# EAGLE board Blueberry Pi (EAGLE 9.0.0), part 1 of 2
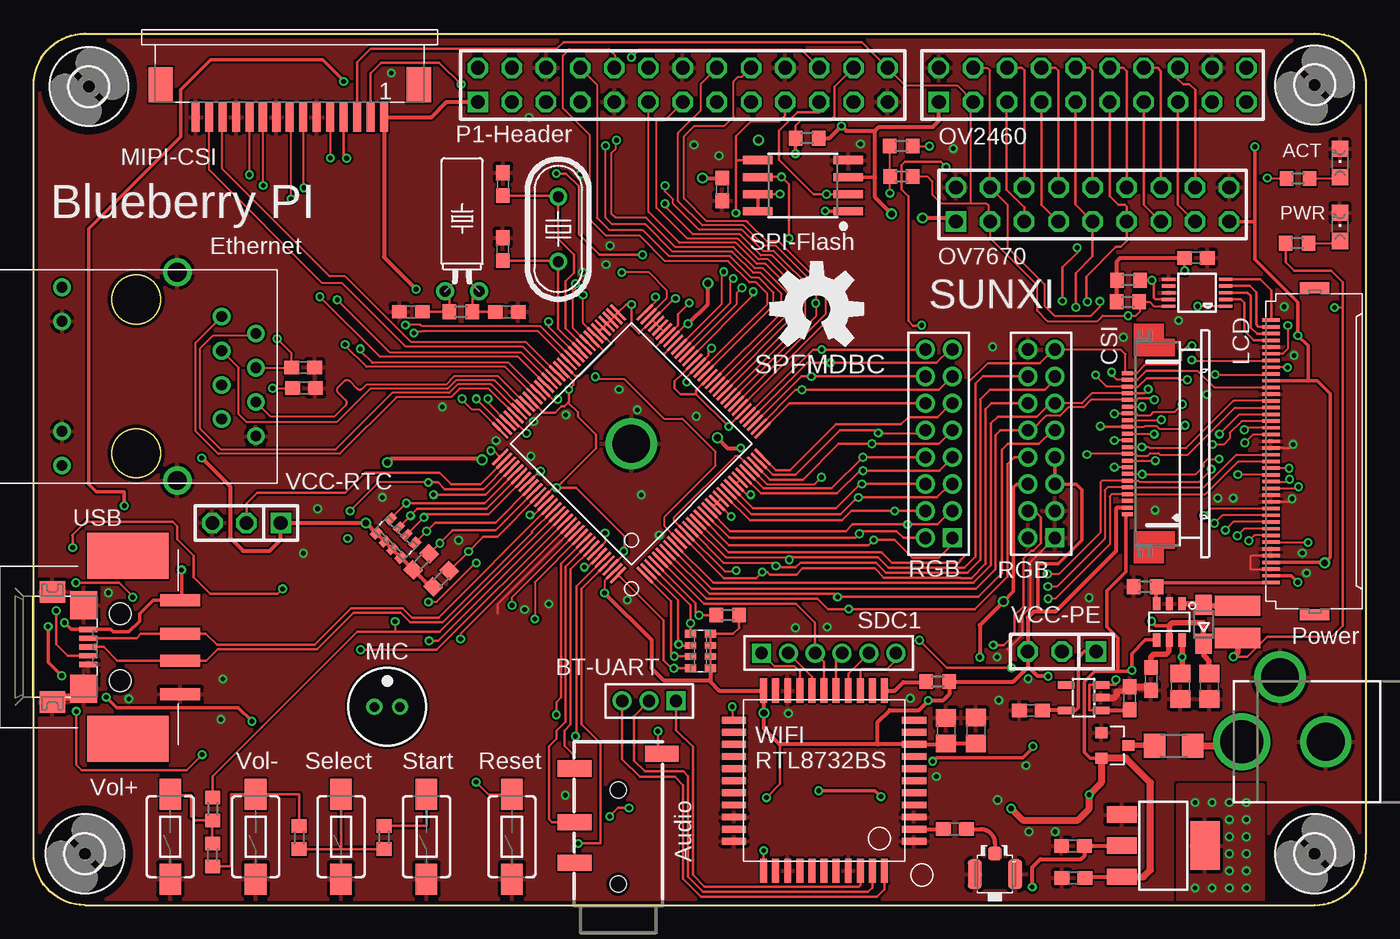
[diagram p4: board, top side]
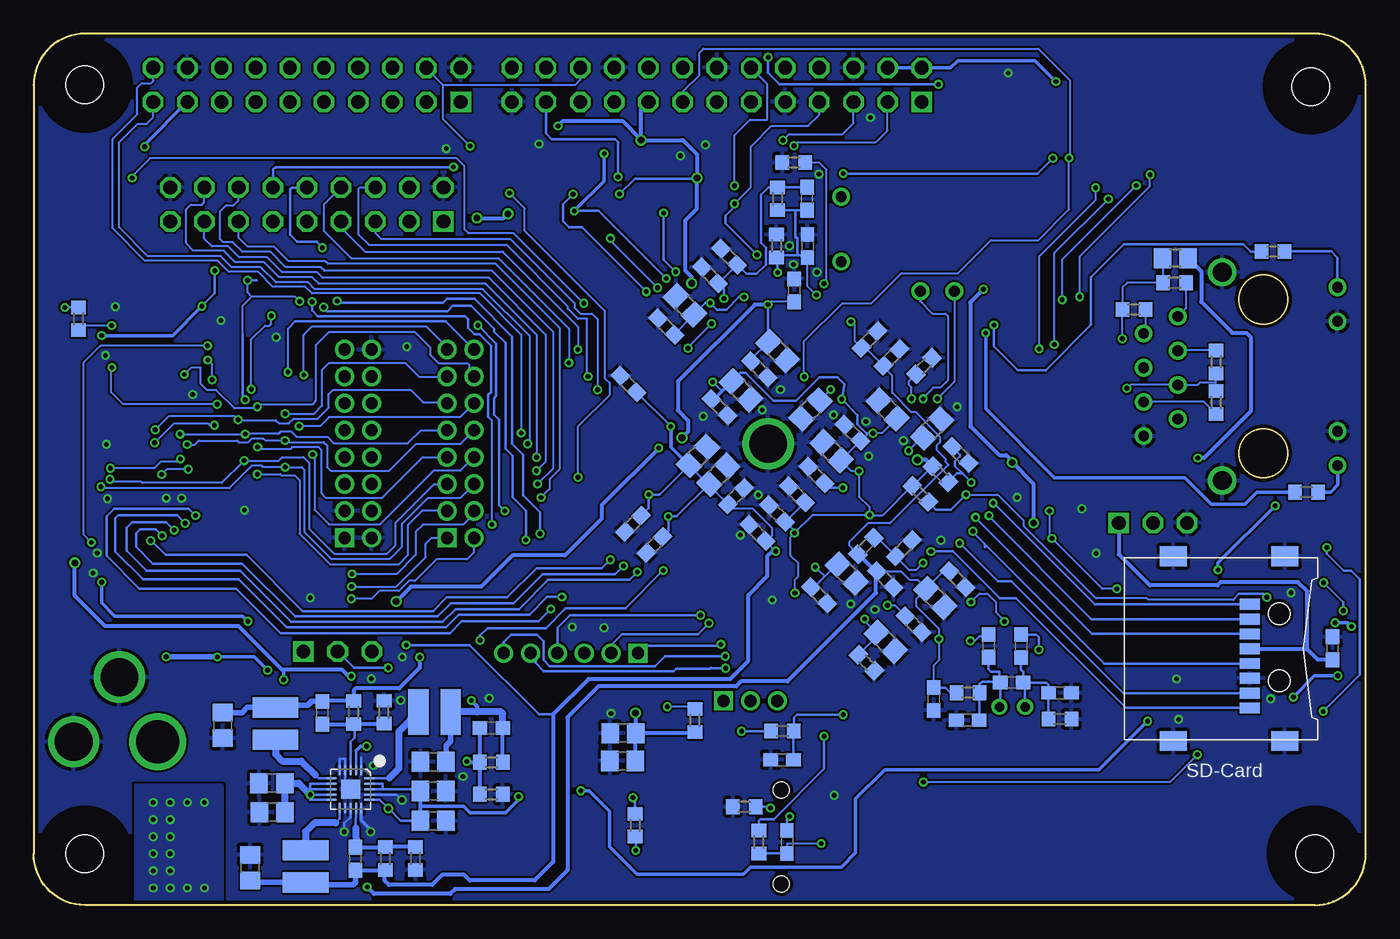
[diagram p5: board, bottom side, seen from below]

Size 99.06 x 64.77 mm. Coordinates in mm from the lower left corner, seen from the top.
Outline: 3.81,0 95.25,0 arc90 99.06,3.81 99.06,60.96 arc90 95.25,64.77 3.81,64.77 arc90 0,60.96 0,3.81 arc90 3.81,0
Copper layers (1*16): Top 0.035mm / dielectric 1.5mm / Bottom 0.035mm
Design rules "SeeedStudio_2layer_DRU_no_angle_20140221": minimum track width 6mil, minimum drill 12mil, track to track 6mil, track to pad 6mil, pad to pad 6mil, via to via 6mil, smd to smd 0mil, copper to edge 10mil, drill to drill 10mil, minimum pad ring 10mil, minimum via ring 6mil, stop-mask expansion 2mil, vias tented up to drill 100mil, thermal gap 10mil
Net classes: 0 default: clearance 0.152 mm

## Footprints (pad centres in the part's own frame; a part is rotated, then mirrored left to right if it is on the bottom)
U-FL3P-SMD-2.6X2.6X1.0MM = smd 1.05 x 1: D -1.524,0 | smd 2.2 x 1.05: GND1 0,1.5; GND2 0,-1.5
C0603 = smd 1.1 x 1: 1 -0.85,0; 2 0.85,0
C0805 = smd 1.3 x 1.5: 1 -0.95,0; 2 0.95,0
DCJACK_2MM_PTH = drill 2.8: GND 0,7.35; GNDBREAK 4.8,10.75 | drill 3.2: PWR 0,13.6
SOD323-W = smd 1.5 x 1.2: A 1.45,0; C -1.45,0
R1206 = smd 1.6 x 1.803: 1 -1.422,0; 2 1.422,0
2,8 = hole 2.8: 0,0
SOT223 = smd 1.219 x 2.235: 1 -2.311,-3.099; 2 0,-3.099; 3 2.311,-3.099 | smd 3.6 x 2.2: 4 0,3.099
TRANSFLASH-LOCK-SOCK = smd 0.8 x 1.5: 1 3.3,-0.46; 2 2.2,-0.46; 3 1.1,-0.46; 4 0,-0.46; 5 -1.1,-0.46; 6 -2.2,-0.46; 7 -3.3,-0.46; 8 -4.4,-0.46 | smd 1.45 x 2: S1 -6.875,-3.06; S2 -6.875,5.24; S3 6.875,5.24; S4 6.875,-3.06
AUDIO_JACK_3.5MM_TRRS_SMD_RA = smd 1.2 x 2.5: EARTH 11.3,-3.25; RING1 6.2,3.25; RING2 3.2,3.25; TIP 10.2,3.25 | hole 1.2: 1.6,0; 8.6,0
XF2H-4015-1LW = smd 1.3 x 0.25: 1 3.175,9.75; 2 3.175,9.25; 3 3.175,8.75; 4 3.175,8.25; 5 3.175,7.75; 6 3.175,7.25; 7 3.175,6.75; 8 3.175,6.25; 9 3.175,5.75; 10 3.175,5.25; 11 3.175,4.75; 12 3.175,4.25; 13 3.175,3.75; 14 3.175,3.25; 15 3.175,2.75; 16 3.175,2.25; 17 3.175,1.75; 18 3.175,1.25; 19 3.175,0.75; 20 3.175,0.25; 21 3.175,-0.25; 22 3.175,-0.75; 23 3.175,-1.25; 24 3.175,-1.75; 25 3.175,-2.25; 26 3.175,-2.75; 27 3.175,-3.25; 28 3.175,-3.75; 29 3.175,-4.25; 30 3.175,-4.75; 31 3.175,-5.25; 32 3.175,-5.75; 33 3.175,-6.25; 34 3.175,-6.75; 35 3.175,-7.25; 36 3.175,-7.75; 37 3.175,-8.25; 38 3.175,-8.75; 39 3.175,-9.25; 40 3.175,-9.75 | smd 2.2 x 0.8: M1 -0.075,12.15; M2 -0.075,-12.15
68611514122 = smd 0.6 x 2.2: 1 -7,2.4; 2 -6,2.4; 3 -5,2.4; 4 -4,2.4; 5 -3,2.4; 6 -2,2.4; 7 -1,2.4; 8 0,2.4; 9 1,2.4; 10 2,2.4; 11 3,2.4; 12 4,2.4; 13 5,2.4; 14 6,2.4; 15 7,2.4 | smd 1.8 x 2.6: Z1 -9.6,0; Z2 9.6,0
2X13 = drill 1.016 square: 1 -15.24,-1.27 | drill 1.016 octagon: 2 -15.24,1.27; 3 -12.7,-1.27; 4 -12.7,1.27; 5 -10.16,-1.27; 6 -10.16,1.27; 7 -7.62,-1.27; 8 -7.62,1.27; 9 -5.08,-1.27; 10 -5.08,1.27; 11 -2.54,-1.27; 12 -2.54,1.27; 13 0,-1.27; 14 0,1.27; 15 2.54,-1.27; 16 2.54,1.27; 17 5.08,-1.27; 18 5.08,1.27; 19 7.62,-1.27; 20 7.62,1.27; 21 10.16,-1.27; 22 10.16,1.27; 23 12.7,-1.27; 24 12.7,1.27; 25 15.24,-1.27; 26 15.24,1.27
1X06M = drill 0.914 square: 1 -5,0 | drill 0.914: 2 -3,0; 3 -1,0; 4 1,0; 5 3,0; 6 5,0
1X03 = drill 1.016 square: 1 -2.54,0 | drill 1.016 octagon: 2 0,0; 3 2.54,0
2X09 = drill 1.016 square: 1 -10.16,-1.27 | drill 1.016 octagon: 2 -10.16,1.27; 3 -7.62,-1.27; 4 -7.62,1.27; 5 -5.08,-1.27; 6 -5.08,1.27; 7 -2.54,-1.27; 8 -2.54,1.27; 9 0,-1.27; 10 0,1.27; 11 2.54,-1.27; 12 2.54,1.27; 13 5.08,-1.27; 14 5.08,1.27; 15 7.62,-1.27; 16 7.62,1.27; 17 10.16,-1.27; 18 10.16,1.27
1X03M = drill 0.914 square: 1 -2,0 | drill 0.914: 2 0,0; 3 2,0
2X10 = drill 1.016 square: 1 -11.43,-1.27 | drill 1.016 octagon: 2 -11.43,1.27; 3 -8.89,-1.27; 4 -8.89,1.27; 5 -6.35,-1.27; 6 -6.35,1.27; 7 -3.81,-1.27; 8 -3.81,1.27; 9 -1.27,-1.27; 10 -1.27,1.27; 11 1.27,-1.27; 12 1.27,1.27; 13 3.81,-1.27; 14 3.81,1.27; 15 6.35,-1.27; 16 6.35,1.27; 17 8.89,-1.27; 18 8.89,1.27; 19 11.43,-1.27; 20 11.43,1.27
2X08M = drill 0.914 square: 1 -7,-1 | drill 0.914: 2 -7,1; 3 -5,-1; 4 -5,1; 5 -3,-1; 6 -3,1; 7 -1,-1; 8 -1,1; 9 1,-1; 10 1,1; 11 3,-1; 12 3,1; 13 5,-1; 14 5,1; 15 7,-1; 16 7,1
ODD-INDUCTOR = smd 1.5 x 3.4: P$1 -1.2,0; P$2 1.2,0
L0805 = smd 1.3 x 1.5: 1 -0.95,0; 2 0.95,0
CHIPLED_0805 = smd 1.2 x 1.2: A 0,-1.05; C 0,1.05
F6035AP = drill 0.7 pad 1.2: 1 0,0.95; 2 0,-0.95
HC49U-V = drill 0.813: 1 -2.413,0; 2 2.413,0
TC38H = drill 0.813: 1 -1.27,0; 2 1.27,0
R0603 = smd 1 x 1.1: 1 -0.85,0; 2 0.85,0
EXB38V = smd 0.6 x 0.8: 1 -1.275,-0.75; 4 1.275,-0.75; 5 1.275,0.75; 8 -1.275,0.75 | smd 0.5 x 0.8: 2 -0.4,-0.75; 3 0.4,-0.75; 6 0.4,0.75; 7 -0.4,0.75
TACTILE_SWITCH_SMD_6.0X3.5MM = smd 2.3 x 1.6: 1 -3.15,0; 2 3.15,0
SO08-EIAJ = smd 0.61 x 2.21: 1 -1.905,-3.378; 2 -0.635,-3.378; 3 0.635,-3.378; 4 1.905,-3.378; 5 1.905,3.353; 6 0.635,3.353; 7 -0.635,3.353; 8 -1.905,3.353
QFP-128 = smd 0.2 x 1.6: 1 -6.2,-7.6; 2 -5.8,-7.6; 3 -5.4,-7.6; 4 -5,-7.6; 5 -4.6,-7.6; 6 -4.2,-7.6; 7 -3.8,-7.6; 8 -3.4,-7.6; 9 -3,-7.6; 10 -2.6,-7.6; 11 -2.2,-7.6; 12 -1.8,-7.6; 13 -1.4,-7.6; 14 -1,-7.6; 15 -0.6,-7.6; 16 -0.2,-7.6; 17 0.2,-7.6; 18 0.6,-7.6; 19 1,-7.6; 20 1.4,-7.6; 21 1.8,-7.6; 22 2.2,-7.6; 23 2.6,-7.6; 24 3,-7.6; 25 3.4,-7.6; 26 3.8,-7.6; 27 4.2,-7.6; 28 4.6,-7.6; 29 5,-7.6; 30 5.4,-7.6; 31 5.8,-7.6; 32 6.2,-7.6; 65 6.2,7.6; 66 5.8,7.6; 67 5.4,7.6; 68 5,7.6; 69 4.6,7.6; 70 4.2,7.6; 71 3.8,7.6; 72 3.4,7.6; 73 3,7.6; 74 2.6,7.6; 75 2.2,7.6; 76 1.8,7.6; 77 1.4,7.6; 78 1,7.6; 79 0.6,7.6; 80 0.2,7.6; 81 -0.2,7.6; 82 -0.6,7.6; 83 -1,7.6; 84 -1.4,7.6; 85 -1.8,7.6; 86 -2.2,7.6; 87 -2.6,7.6; 88 -3,7.6; 89 -3.4,7.6; 90 -3.8,7.6; 91 -4.2,7.6; 92 -4.6,7.6; 93 -5,7.6; 94 -5.4,7.6; 95 -5.8,7.6; 96 -6.2,7.6 | smd 1.6 x 0.2: 33 7.6,-6.2; 34 7.6,-5.8; 35 7.6,-5.4; 36 7.6,-5; 37 7.6,-4.6; 38 7.6,-4.2; 39 7.6,-3.8; 40 7.6,-3.4; 41 7.6,-3; 42 7.6,-2.6; 43 7.6,-2.2; 44 7.6,-1.8; 45 7.6,-1.4; 46 7.6,-1; 47 7.6,-0.6; 48 7.6,-0.2; 49 7.6,0.2; 50 7.6,0.6; 51 7.6,1; 52 7.6,1.4; 53 7.6,1.8; 54 7.6,2.2; 55 7.6,2.6; 56 7.6,3; 57 7.6,3.4; 58 7.6,3.8; 59 7.6,4.2; 60 7.6,4.6; 61 7.6,5; 62 7.6,5.4; 63 7.6,5.8; 64 7.6,6.2; 97 -7.6,6.2; 98 -7.6,5.8; 99 -7.6,5.4; 100 -7.6,5; 101 -7.6,4.6; 102 -7.6,4.2; 103 -7.6,3.8; 104 -7.6,3.4; 105 -7.6,3; 106 -7.6,2.6; 107 -7.6,2.2; 108 -7.6,1.8; 109 -7.6,1.4; 110 -7.6,1; 111 -7.6,0.6; 112 -7.6,0.2; 113 -7.6,-0.2; 114 -7.6,-0.6; 115 -7.6,-1; 116 -7.6,-1.4; 117 -7.6,-1.8; 118 -7.6,-2.2; 119 -7.6,-2.6; 120 -7.6,-3; 121 -7.6,-3.4; 122 -7.6,-3.8; 123 -7.6,-4.2; 124 -7.6,-4.6; 125 -7.6,-5; 126 -7.6,-5.4; 127 -7.6,-5.8; 128 -7.6,-6.2 | drill 2.8: P$1 0,0
LGA = smd 1.8 x 0.51: P$1 -0.7,10.5; P$2 -0.7,9.6; P$3 -0.7,8.7; P$4 -0.7,7.8; P$5 -0.7,6.9; P$6 -0.7,6; P$7 -0.7,5.1; P$8 -0.7,4.2; P$9 -0.7,3.3; P$10 -0.7,2.4; P$11 -0.7,1.5; P$23 12.7,1.5; P$24 12.7,2.4; P$25 12.7,3.3; P$26 12.7,4.2; P$27 12.7,5.1; P$28 12.7,6; P$29 12.7,6.9; P$30 12.7,7.8; P$31 12.7,8.7; P$32 12.7,9.6; P$33 12.7,10.5 | smd 0.51 x 1.8: P$12 1.5,-0.7; P$13 2.4,-0.7; P$14 3.3,-0.7; P$15 4.2,-0.7; P$16 5.1,-0.7; P$17 6,-0.7; P$18 6.9,-0.7; P$19 7.8,-0.7; P$20 8.7,-0.7; P$21 9.6,-0.7; P$22 10.5,-0.7; P$34 10.5,12.7; P$35 9.6,12.7; P$36 8.7,12.7; P$37 7.8,12.7; P$38 6.9,12.7; P$39 6,12.7; P$40 5.1,12.7; P$41 4.2,12.7; P$42 3.3,12.7; P$43 2.4,12.7; P$44 1.5,12.7
RJ45 = drill 0.8: 1 -6.03,-4.12; 2 -8.57,-2.86; 3 -6.03,-1.58; 4 -8.57,-0.32; 5 -6.03,0.96; 6 -8.57,2.22; 7 -6.03,3.5; 8 -8.57,4.76; 9 5.84,-6.305; 10 5.84,-3.765; 11 5.84,4.405; 12 5.84,6.945 | drill 1.4: SHIELD1 -2.73,-7.425; SHIELD2 -2.73,8.065
QFN20 = smd 0.2 x 0.8: 1 -0.8,-1.4; 2 -0.4,-1.4; 3 0,-1.4; 4 0.4,-1.4; 5 0.8,-1.4; 11 0.8,1.4; 12 0.4,1.4; 13 0,1.4; 14 -0.4,1.4; 15 -0.8,1.4 | smd 0.8 x 0.2: 6 1.4,-0.8; 7 1.4,-0.4; 8 1.4,0; 9 1.4,0.4; 10 1.4,0.8; 16 -1.4,0.8; 17 -1.4,0.4; 18 -1.4,0; 19 -1.4,-0.4; 20 -1.4,-0.8 | smd 1.4 x 1.4: 21 0,0
CON-HIROSE_ZX62R-B-5P = smd 1.35 x 0.4: 1 2.675,1.3; 2 2.675,0.65; 3 2.675,0; 4 2.675,-0.65; 5 2.675,-1.3 | smd 1.9 x 1.6: M1 0,-4.1; M2 0,4.1 | smd 2 x 2.1: M3 2.35,3.1; M4 2.35,-3.1
SOT25 = smd 0.55 x 1.2: 1 -0.95,-1.3; 2 0,-1.3; 3 0.95,-1.3; 4 0.95,1.3; 5 -0.95,1.3
SOT23-3 = smd 0.8 x 0.9: 1 -0.95,-1; 2 0.95,-1; 3 0,1
MSOP10 = smd 0.25 x 1: 1 -1,-2.113; 2 -0.5,-2.113; 3 0,-2.113; 4 0.5,-2.113; 5 1,-2.113; 6 1,2.113; 7 0.5,2.113; 8 0,2.113; 9 -0.5,2.113; 10 -1,2.113
SOT23-6 = smd 1 x 0.55: 1 -1.35,0.95; 2 -1.35,0; 3 -1.35,-0.95; 4 1.35,-0.95; 5 1.35,0; 6 1.35,0.95
USB-B-SMT = smd 6.04 x 3.4: 5 0.58,6.8; 6 0.58,-6.8 | smd 3 x 0.9: D+ 4.46,-1; D- 4.46,1; GND 4.46,-3.5; VBUS 4.46,3.5 | hole 1.6: 0,2.5; 0,-2.5
52745-2290 = smd 0.3 x 0.8: 1 -5.25,2.5; 2 -4.75,2.5; 3 -4.25,2.5; 4 -3.75,2.5; 5 -3.25,2.5; 6 -2.75,2.5; 7 -2.25,2.5; 8 -1.75,2.5; 9 -1.25,2.5; 10 -0.75,2.5; 11 -0.25,2.5; 12 0.25,2.5; 13 0.75,2.5; 14 1.25,2.5; 15 1.75,2.5; 16 2.25,2.5; 17 2.75,2.5; 18 3.25,2.5; 19 3.75,2.5; 20 4.25,2.5; 21 4.75,2.5; 22 5.25,2.5

## Placement (x,y rotation side)
ANT2  U-FL  [U-FL3P-SMD-2.6X2.6X1.0MM]  71.48,2.3 270 top
C1  100nF  [C0603]  51.19,53.19 270 top
C2  100nF  [C0603]  86.43,48.11 0 top
C3  10µF  [C0805]  67.85,12.97 90 top
C4  33pF  [C0603]  68.5,5.64 0 top
C5  10µF  [C0805]  55.26,10.71 180 bottom
C6  10µF  [C0805]  70.06,12.97 90 top
C7  10µF  [C0805]  32.26,35.42 45 bottom
C8  18pF  [C0603]  28.05,44.1 180 top
C9  100nF  [C0603]  2.47,19.08 90 bottom
C10  18pF  [C0603]  35.18,44.08 0 top
C11  18pF  [C0603]  34.9,53.59 270 top
C12  18pF  [C0603]  34.88,48.76 270 top
C13  1µF  [C0603]  30.15,33.46 315 bottom
C14  100nF  [C0603]  41.55,52.5 90 bottom
C15  100nF  [C0603]  41.52,48.99 270 bottom
C16  10µF  [C0805]  32.02,22.83 135 bottom
C17  1µF  [C0603]  43.4,10.8 180 bottom
C18  100nF  [C0603]  43.05,4.69 270 bottom
C19  100nF  [C0603]  30.37,24.23 135 bottom
C20  10µF  [C0805]  35.71,19.58 135 bottom
C21  1µF  [C0603]  33.63,20.88 135 bottom
C22  100nF  [C0603]  40.66,23.02 315 bottom
C23  33pF  [C0603]  29.6,13.73 0 bottom
C24  33pF  [C0603]  22.74,15.78 180 bottom
C25  100pF  [C0603]  26.33,16.54 180 bottom
C26  33pF  [C0603]  32.13,15.31 90 bottom
C27  100nF  [C0603]  28.06,19.26 270 bottom
C28  100nF  [C0603]  25.65,19.25 270 bottom
C29  10µF  [C0805]  38.59,24.64 135 bottom
C30  10µF  [C0805]  55.24,12.78 180 bottom
C31  100nf  [C0603]  81.5,15.38 90 top
C32  10µF  [C0805]  81.34,9.06 180 bottom
C33  10µF  [C0805]  81.32,6.89 180 bottom
C34  1nF  [C0603]  34.36,26.52 225 bottom
C35  10µF  [C0805]  69.36,6.26 0 bottom
C36  100nf  [C0603]  77.31,2.02 180 top
C37  100nf  [C0603]  77.29,4.39 180 top
C38  10µF  [C0603]  48.77,46.8 315 bottom
C39  1µF  [C0603]  45.11,39.82 315 bottom
C40  10µF  [C0805]  69.37,8.47 0 bottom
C41  18pF  [C0603]  75.12,3.44 90 bottom
C42  18pF  [C0603]  77.6,14.28 270 bottom
C43  10µF  [C0805]  84.99,13.35 90 bottom
C44  10µF  [C0805]  82.97,2.78 270 bottom
C45  18pF  [C0603]  65.03,13.15 180 bottom
C46  10µF  [C0805]  69.35,10.64 0 bottom
C47  1µF  [C0603]  47.35,48.18 135 bottom
C48  100nF  [C0603]  20.1,38.42 0 top
C49  100nF  [C0603]  20.04,39.96 0 top
C50  100nF  [C0805]  43.74,41.17 315 bottom
C51  100nF  [C0603]  42.49,45.69 90 bottom
C52  100nF  [C0805]  50.63,44.58 135 bottom
C53  100nF  [C0603]  52.02,43 135 bottom
C54  1µF  [C0805]  48.15,31.98 45 bottom
C55  1µF  [C0603]  54.49,28.34 225 bottom
C56  10µF  [C0603]  45.25,27.66 135 bottom
C57  100nF  [C0603]  43.78,29.1 135 bottom
C58  100nF  [C0603]  38.17,35.1 135 bottom
C59  1µF  [C0805]  39.72,33.73 135 bottom
C60  10µF  [C0603]  42.31,30.54 135 bottom
C61  1µF  [C0805]  46.46,38.26 315 bottom
C62  100nF  [C0603]  40.86,31.96 135 bottom
C63  100nF  [C0805]  49.66,33.37 45 bottom
C64  1µF  [C0603]  54.84,38.73 135 bottom
C65  1µF  [C0603]  46.84,30.4 45 bottom
C66  10µF  [C0805]  41.3,36.83 225 bottom
C67  100nF  [C0603]  52.89,26.78 225 bottom
C68  100nF  [C0603]  35.74,24.22 315 bottom
C69  100nF  [C0805]  35.56,36.83 135 bottom
C70  100nF  [C0603]  48.07,37 315 bottom
C71  10µF  [C0603]  35.28,40.7 45 bottom
C72  100nF  [C0603]  36.91,42.04 45 bottom
C73  10µF  [C0805]  85.26,16.28 270 top
C74  10µF  [C0805]  87.41,16.26 270 top
C75  100nf  [C0603]  83.08,16.81 270 top
C76  100nf  [C0603]  74.15,14.46 180 top
CN2  [DCJACK_2MM_PTH]  103.43,12.14 90 top
D1  [SOD323-W]  87,20.86 90 top
F1  2A  [R1206]  84.75,11.84 180 top
H1  MOUNT-HOLE2.8  [2,8]  95.25,3.81 0 top
H2  MOUNT-HOLE2.8  [2,8]  3.81,3.81 0 top
H3  MOUNT-HOLE2.8  [2,8]  4.11,60.83 0 top
H4  MOUNT-HOLE2.8  [2,8]  95.25,60.96 0 top
IC1  [SOT223]  84,4.41 270 top
J1  TRANSFLASH-LOCK  [TRANSFLASH-LOCK-SOCK]  9.08,19.05 90 bottom
J2  AUDIO_JACK_SMD  [AUDIO_JACK_3.5MM_TRRS_SMD_RA]  43.47,-0.05 90 top
J3  [XF2H-4015-1LW]  95.18,33.72 180 top
J4  [68611514122]  19.05,60.96 180 top
JP1  [2X13]  48.26,60.96 0 top
JP2  [1X06M]  59.11,18.72 0 top
JP3  [1X03]  76.46,18.85 180 top
JP5  [1X03]  15.83,28.4 180 top
JP6  OV7670  [2X09]  78.74,52.07 0 top
JP7  [1X03M]  45.76,15.17 180 top
JP10  OV2640  [2X10]  78.74,60.96 0 top
JP11  [2X08M]  67.31,34.29 90 top
JP12  [2X08M]  74.93,34.29 90 top
L1  2,2µH  [ODD-INDUCTOR]  89.52,21.04 90 top
L2  10µH  [L0805]  14.18,48.07 180 bottom
L3  2,2µH  [ODD-INDUCTOR]  78.84,2.88 90 bottom
L4  2,2µH  [ODD-INDUCTOR]  81.08,13.49 270 bottom
L5  2.2µH  [ODD-INDUCTOR]  69.26,14.35 180 bottom
LED1  [CHIPLED_0805]  97.14,50.4 0 top
LED2  [CHIPLED_0805]  97.14,55.16 0 top
LOGO2  OSHW-LOGOL  [OSHW-LOGO-L]  58.21,44.32 0 top
MIC  [F6035AP]  26.29,14.73 90 top
Q1  24Mhz  [HC49U-V]  39.01,50.24 270 top
Q2  32kHz  [TC38H]  31.86,45.62 0 top
R1  47k  [R0603]  28.81,25.51 225 top
R2  47k  [R0603]  30.31,24.25 225 top
R3  10M  [R0603]  31.78,44.1 180 top
R4  0R  [R0603]  95.72,43.58 90 bottom
R7  150k  [R0603]  72.91,3.45 90 bottom
R8  10k  [R0603]  57.51,57 0 top
R9  100k  [R0603]  67.22,16.61 180 top
R10  100k  [R0603]  54.33,5.93 90 bottom
R11  47k  [R0603]  31.63,32.01 135 bottom
R12  240 - 1%  [R0603]  42.54,55.19 180 bottom
R13  2k - 1%  [R0603]  43.75,52.5 90 bottom
R14  2k - 1%  [R0603]  43.82,48.99 270 bottom
R15  22  [R0603]  46.23,7.31 0 bottom
R16  1k  [R0603]  93.95,49.19 180 top
R17  1k  [R0603]  94.01,54 180 top
R19  10k  [R0603]  49.89,13.72 270 bottom
R20  6k8  [R0603]  13.32,7.14 90 top
R21  8k2  [R0603]  13.3,3.73 90 top
R22  10k  [R0603]  19.75,5.01 90 top
R23  11k  [R0603]  26.06,5.03 270 top
R24  6k 1%  [R0603]  32.85,40.06 45 bottom
R25  2k  [R0603]  43.38,12.93 0 bottom
R26  0  [R0603]  45.13,4.68 270 bottom
R27  200k 1%  [R0603]  37.13,18 135 bottom
R28  2k  [R0603]  22.74,13.83 0 bottom
R29  47k  [R0603]  37.18,26.68 225 bottom
R30  2k  [R0603]  29.58,15.78 180 bottom
R32  47k  [R0603]  33.13,30.56 315 bottom
R36  47k  [R0603]  51.61,21.56 180 top
R38  10k  [R0603]  81.36,44.83 0 top
R39  10k  [R0603]  81.41,46.45 0 top
R40  49.9  [R0603]  11.14,40.37 270 bottom
R41  49.9  [R0603]  11.14,37.35 90 bottom
R42  49.9  [R0603]  14.22,46.26 180 bottom
R43  49.9  [R0603]  17.24,44.26 180 bottom
R44  10k  [R0603]  64.52,54.15 0 top
R45  10k  [R0603]  64.51,56.41 0 top
R47  5,1  [R0603]  82.64,23.66 180 top
R52  1k  [R0603]  4.42,30.69 0 bottom
R53  1k  [R0603]  6.91,48.57 0 bottom
R54  150k  [R0603]  70.67,3.47 90 bottom
R55  200k  [R0603]  75.27,14.32 270 bottom
R56  100k  [R0603]  73.01,14.33 270 bottom
R57  680k  [R0603]  65.03,10.61 180 bottom
R58  150k  [R0603]  65.03,8.23 180 bottom
RN1  [EXB38V]  49.59,18.88 90 top
RN2  [EXB38V]  26.91,27.27 315 top
S1  [TACTILE_SWITCH_SMD_6.0X3.5MM]  10.16,5.08 90 top
S2  [TACTILE_SWITCH_SMD_6.0X3.5MM]  16.51,5.08 90 top
S3  [TACTILE_SWITCH_SMD_6.0X3.5MM]  22.86,5.08 90 top
S4  [TACTILE_SWITCH_SMD_6.0X3.5MM]  29.21,5.08 90 top
S5  [TACTILE_SWITCH_SMD_6.0X3.5MM]  35.56,5.08 90 top
U1  25F32006WSOI  [SO08-EIAJ]  57.2,53.47 90 top
U$1  V3S  [QFP-128]  44.45,34.29 45 top
U$2  RTL8723BS  [LGA]  64.77,15.24 180 top
U$3  HR911105A  [RJ45]  7.95,39.62 180 top
U$4  EA3036  [QFN20]  75.49,8.61 180 bottom
U$5  [CON-HIROSE_ZX62R-B-5P]  1.39,19.18 0 top
U$6  XC6204  [SOT25]  78.07,15.41 90 top
U$7  AP2305BGN  [SOT23-3]  80.39,11.86 270 top
U$8  NS2009  [MSOP10]  86.5,45.51 90 top
U$9  PT4101  [SOT23-6]  84.44,21.04 270 top
X1  USB-B-S  [USB-B-SMT]  6.43,19.16 0 top
X3  52745-2290  [52745-2290]  83.82,34.29 90 top